# Altium schematic sheet top.SchDoc
size Letter; Author: Ye-Sheng Kuo; Organization: Altium Limited; Address1: L3, 12a Rodborough Rd; Address2: Frenchs Forest; Address3: NSW; Address4: Australia 2086; Revision: 1
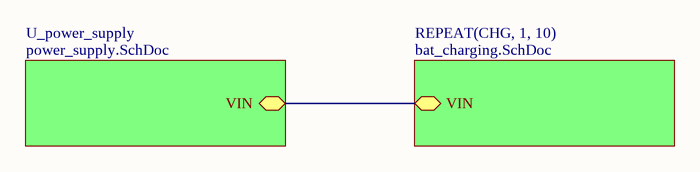
[diagram p0: top.SchDoc]

## Sub-sheets
REPEAT(CHG, 1, 10) = bat_charging.SchDoc: VIN
U_power_supply = power_supply.SchDoc: VIN

## Nets
(unnamed): sheet REPEAT(CHG, 1, 10)/VIN, sheet U_power_supply/VIN

## Notes on the sheet
- Title
- Date:
- Author:
- Revision:
- Sheet
- of
- University of Michigan
- File: